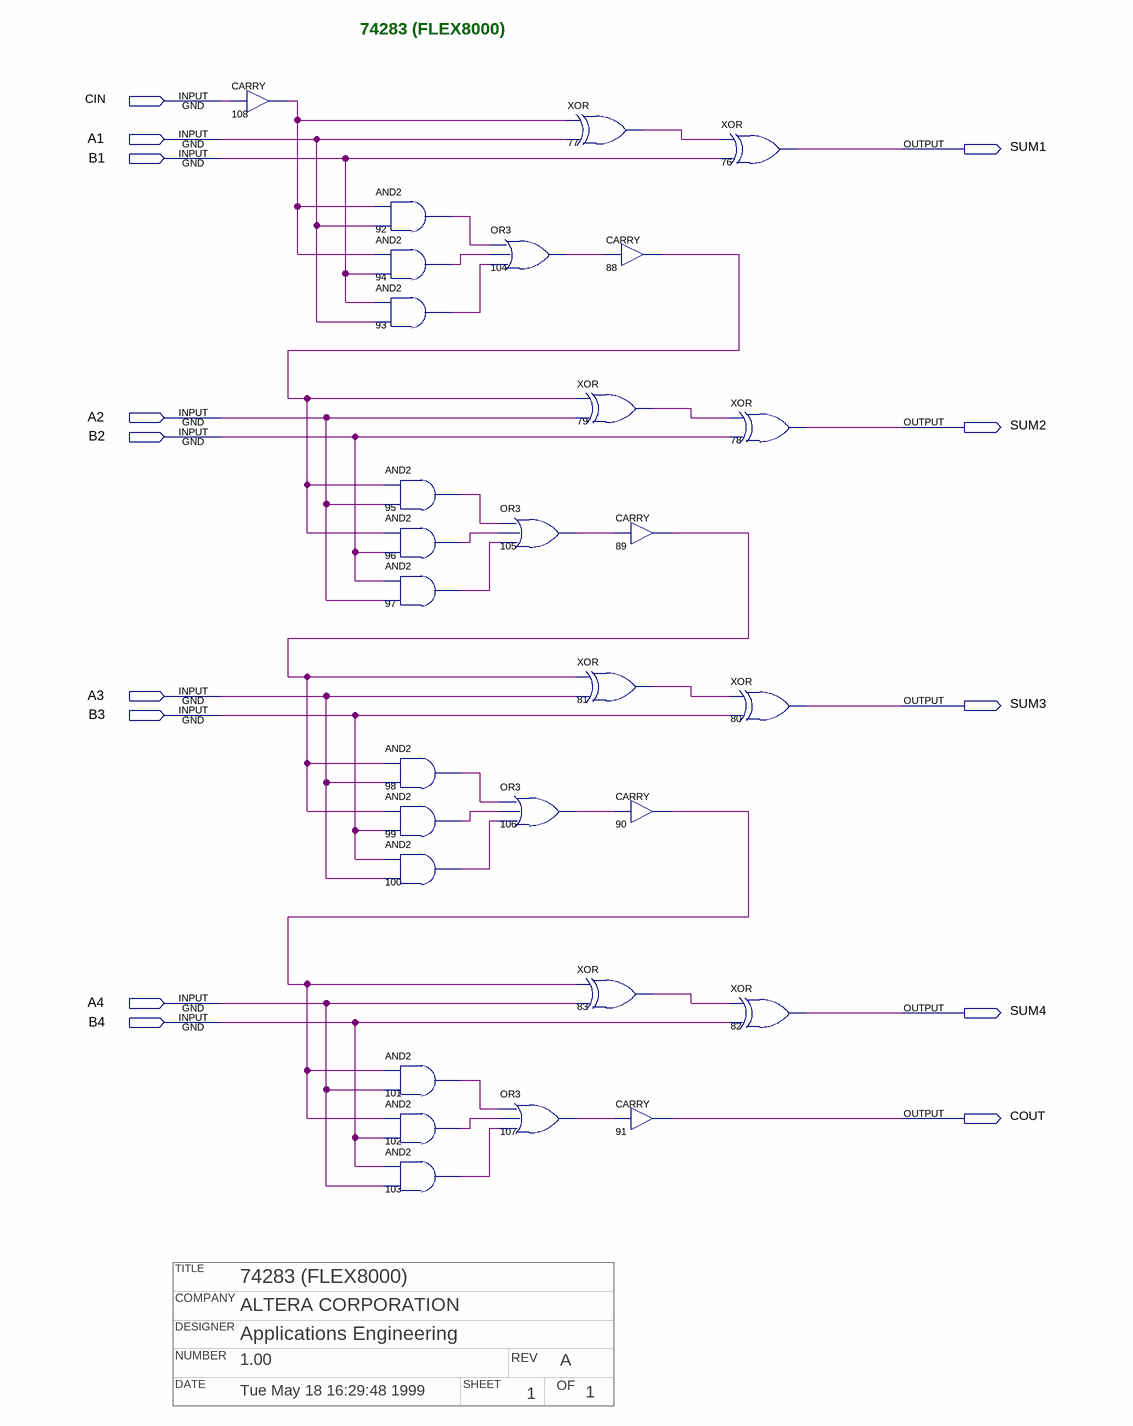
[diagram p0: schematic sheet]
// Quartus schematic f74283.bdf as structural Verilog: 29 symbols, 14 pins
// Title block: TITLE: 74283 (FLEX8000); COMPANY: ALTERA CORPORATION; DESIGNER: Applications Engineering; NUMBER: 1.00; REV: A; DATE: Tue May 18 16:29:48 1999; SHEET: 1; OF: 1
module f74283 (
  input  CIN,
  input  A1,
  input  B1,
  input  A2,
  input  B2,
  input  A3,
  input  B3,
  input  A4,
  input  B4,
  output SUM1,
  output SUM2,
  output SUM3,
  output SUM4,
  output COUT
);

  wire n77_out, n79_out, n81_out, n83_out, n88_out, n89_out, n90_out, n92_out, n93_out, n94_out, n95_out,
       n96_out, n97_out, n98_out, n99_out, n100_out, n101_out, n102_out, n103_out, n104_out, n105_out,
       n106_out, n107_out, n108_out;

  CARRY u_108 (.IN(CIN), .OUT(n108_out));
  and u_92 (n92_out, n108_out, A1);
  and u_94 (n94_out, n108_out, B1);
  and u_93 (n93_out, B1, A1);
  and u_95 (n95_out, n88_out, A2);
  and u_96 (n96_out, n88_out, B2);
  and u_97 (n97_out, B2, A2);
  and u_98 (n98_out, n89_out, A3);
  and u_99 (n99_out, n89_out, B3);
  and u_100 (n100_out, B3, A3);
  and u_101 (n101_out, n90_out, A4);
  and u_102 (n102_out, n90_out, B4);
  and u_103 (n103_out, B4, A4);
  or u_104 (n104_out, n92_out, n94_out, n93_out);
  or u_105 (n105_out, n95_out, n96_out, n97_out);
  or u_106 (n106_out, n98_out, n99_out, n100_out);
  or u_107 (n107_out, n101_out, n102_out, n103_out);
  xor u_77 (n77_out, n108_out, A1);
  CARRY u_88 (.IN(n104_out), .OUT(n88_out));
  xor u_79 (n79_out, n88_out, A2);
  CARRY u_89 (.IN(n105_out), .OUT(n89_out));
  xor u_81 (n81_out, n89_out, A3);
  CARRY u_90 (.IN(n106_out), .OUT(n90_out));
  xor u_83 (n83_out, n90_out, A4);
  CARRY u_91 (.IN(n107_out), .OUT(COUT));
  xor u_76 (SUM1, n77_out, B1);
  xor u_78 (SUM2, n79_out, B2);
  xor u_80 (SUM3, n81_out, B3);
  xor u_82 (SUM4, n83_out, B4);

  // Notes on the sheet:
  //   74283 (FLEX8000)
endmodule
